# EasyEDA Pro project 5000A大电流-加法-v2+-+CT100.eprj, schematic Schematic1

## Sheets
1 P1: Board Name: Board1; Create Date: 2024-03-13; Page Name: P1; Project Name: 5000A大电流-加法-v2 - CT100; Schematic Name: Schematic1; Update Date: 2024-07-10; Company: 嘉立创EDA; Page Size: A4; Version: V1.0
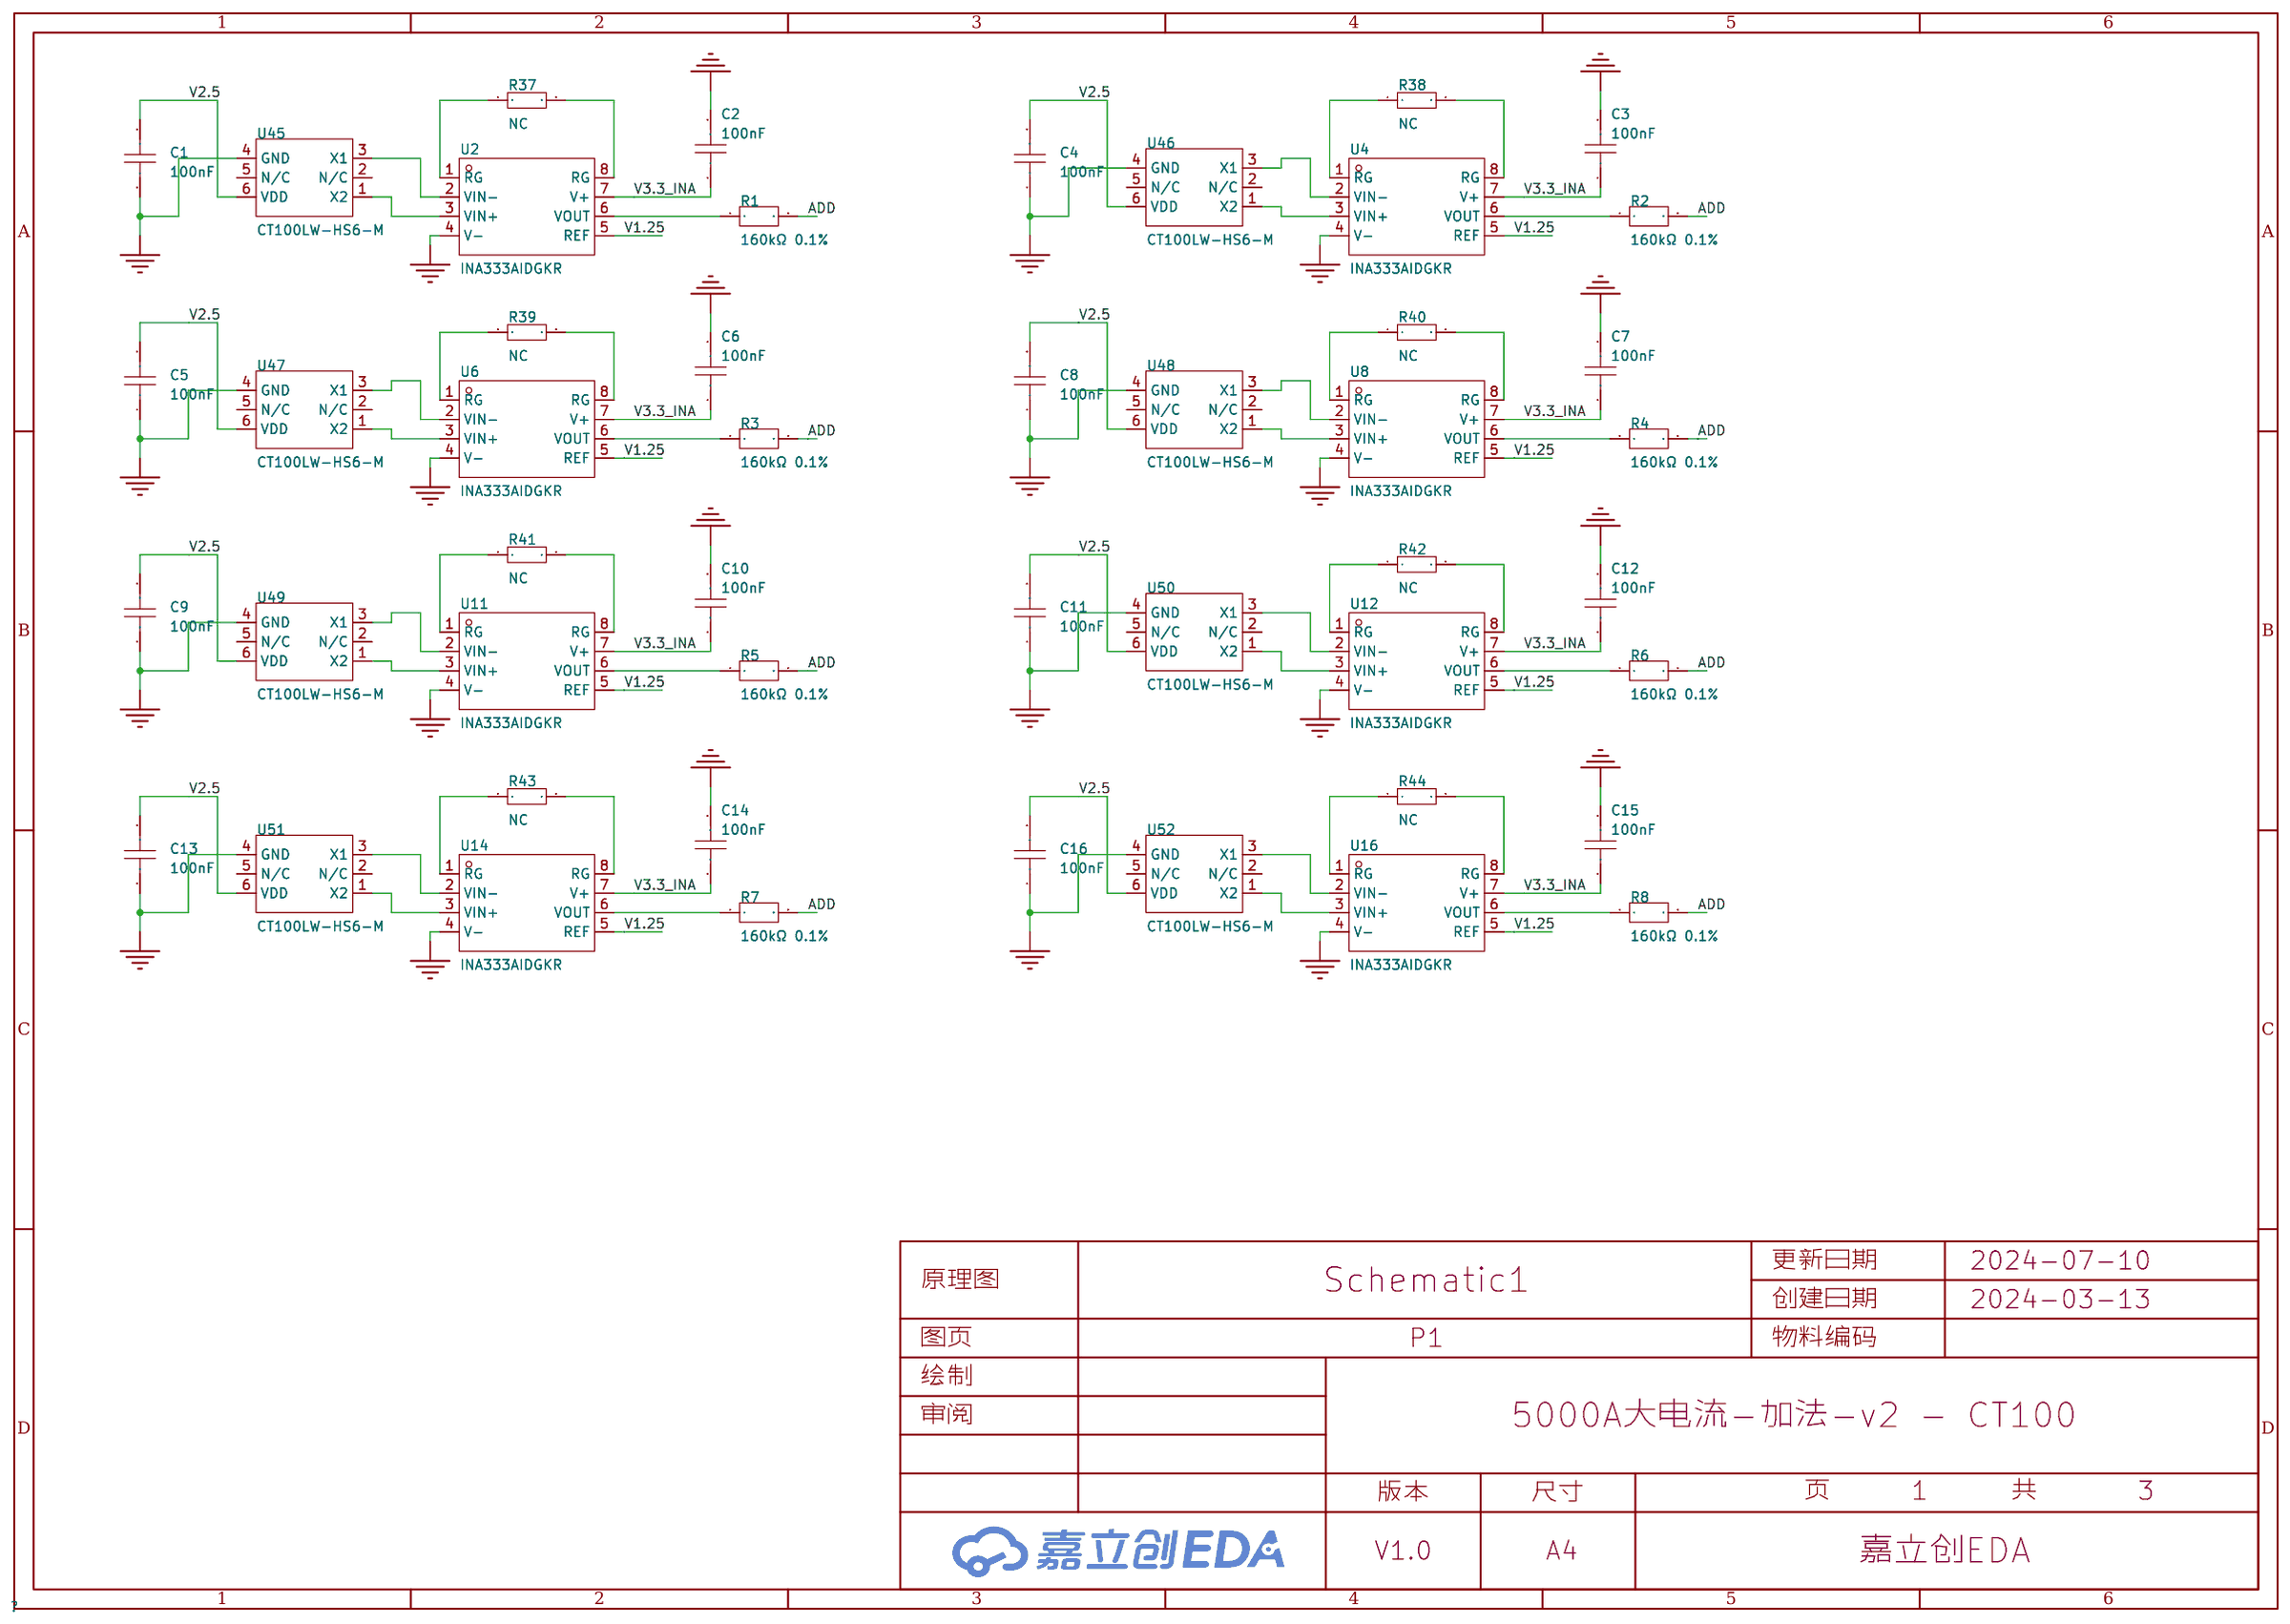
[diagram p0: P1]
2 P4: Page Name: P4; Update Date: 2024-07-25
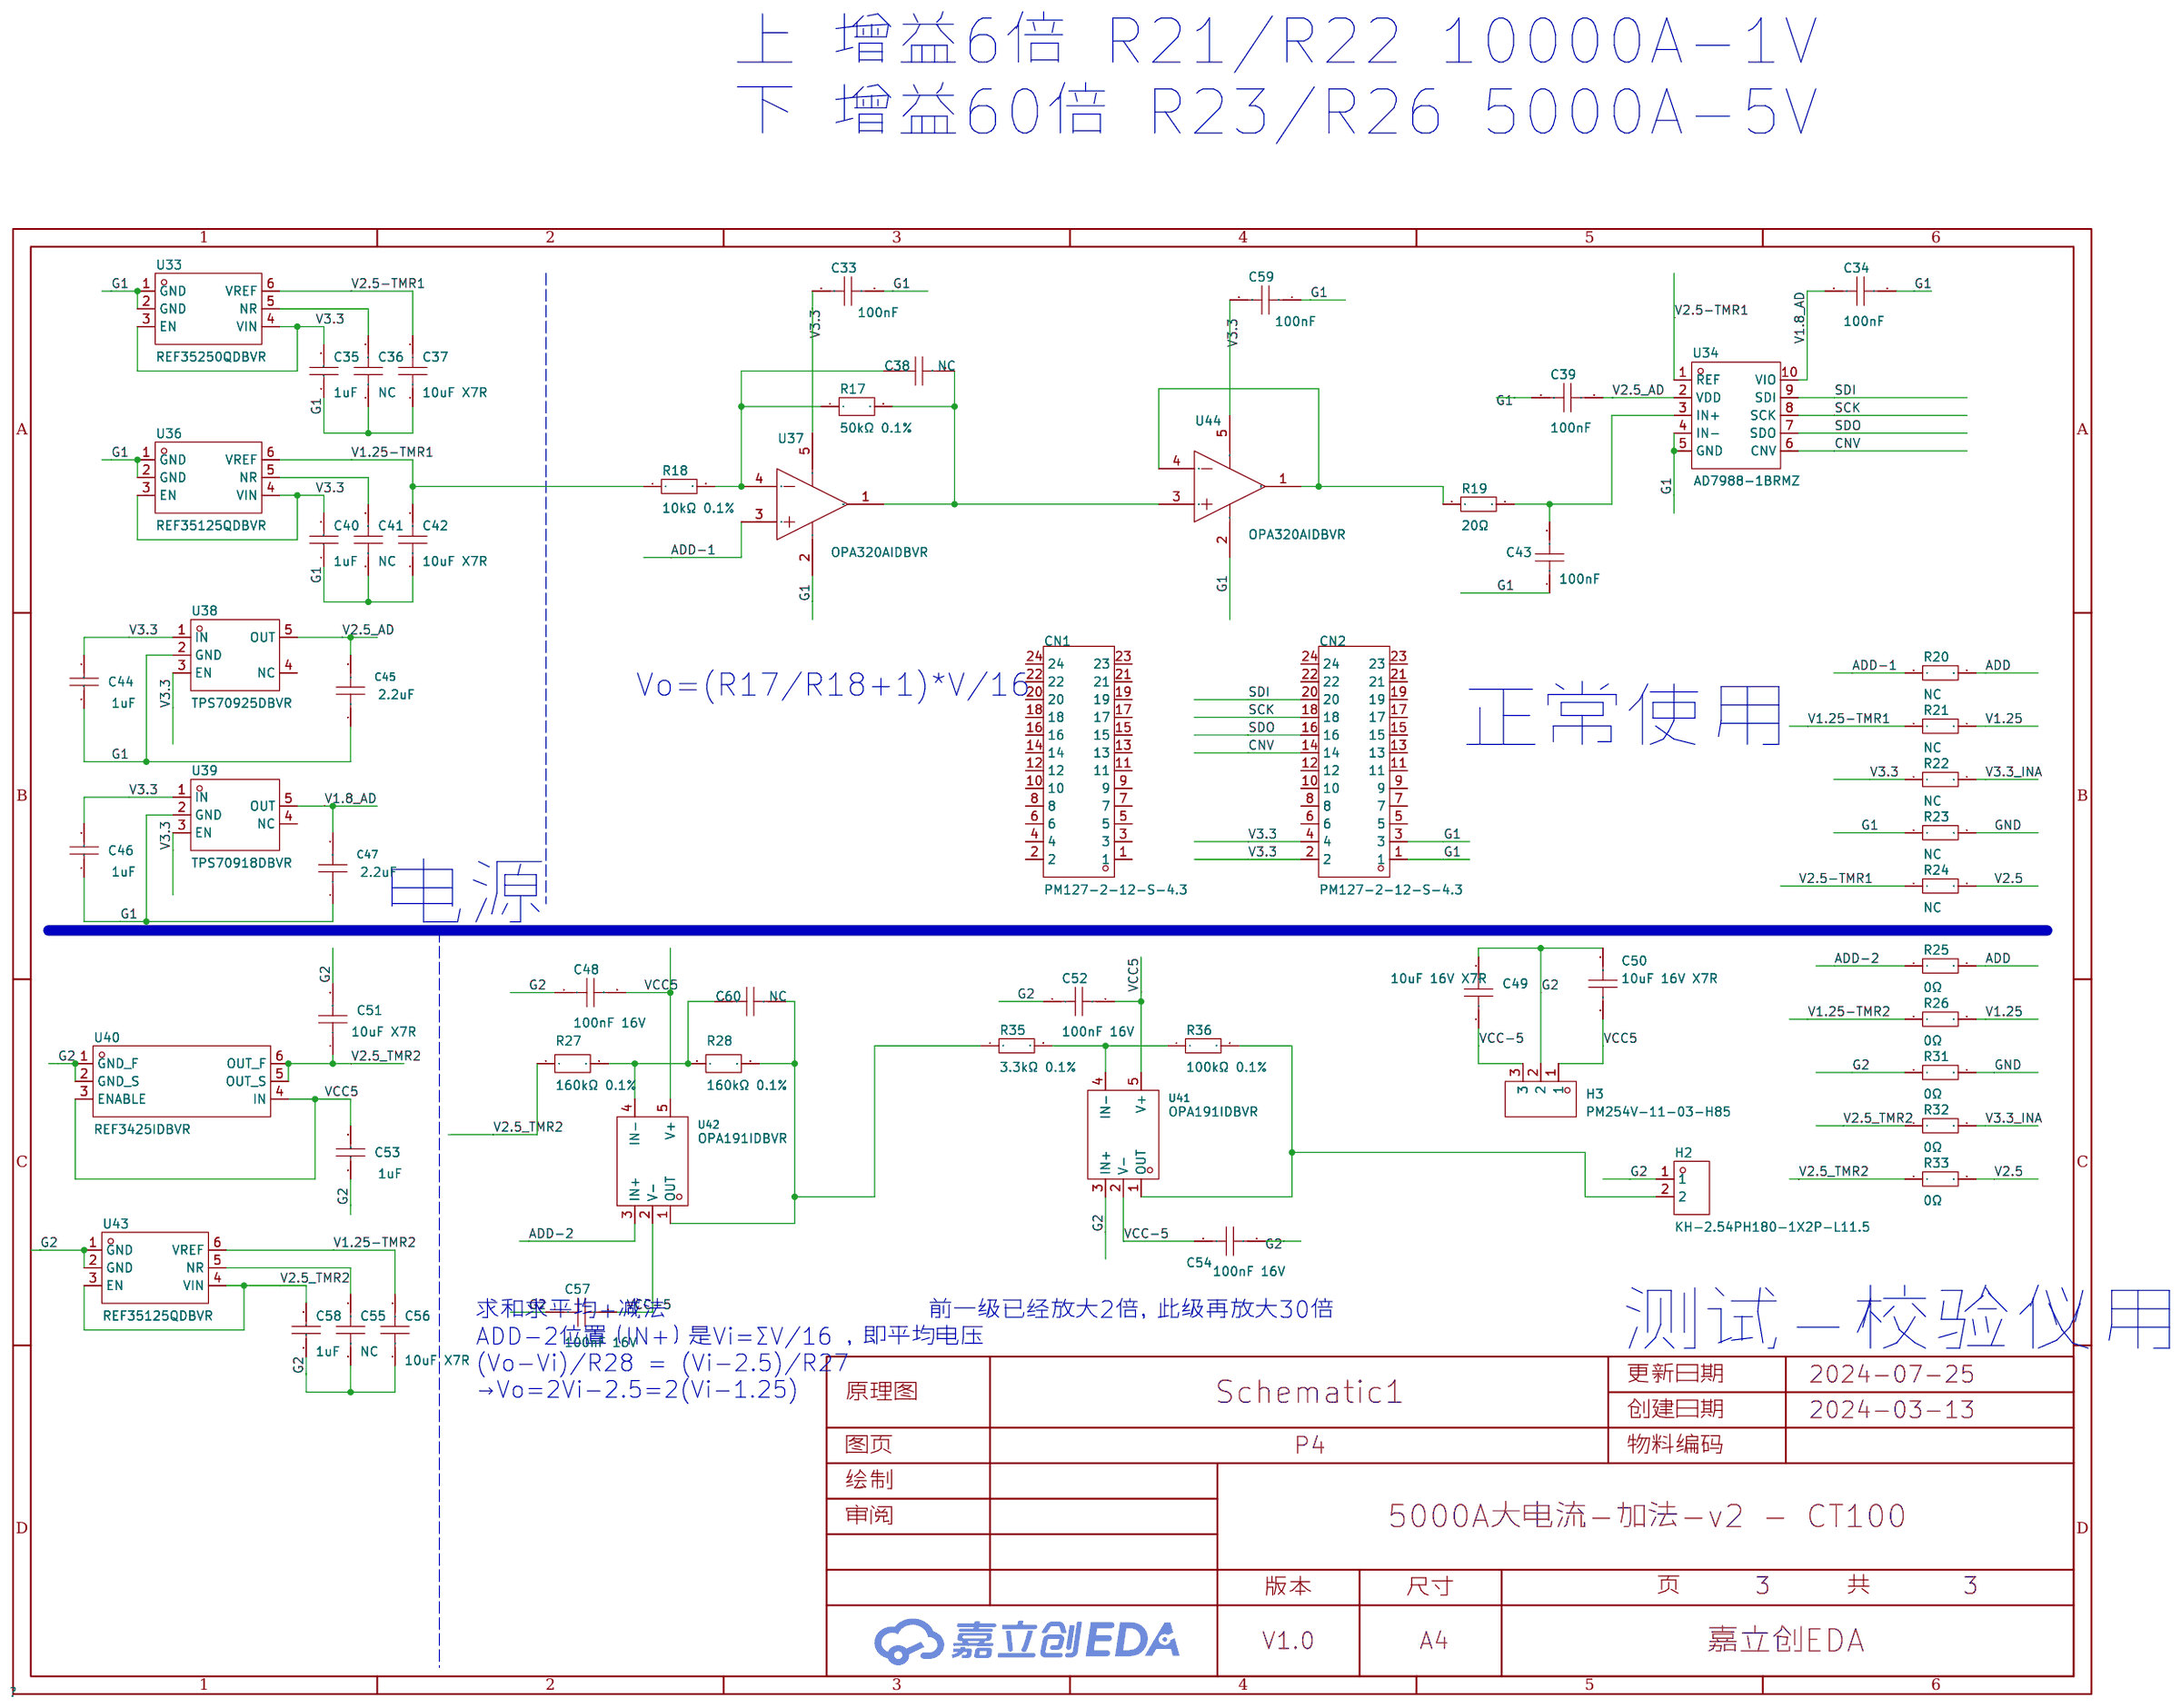
[diagram p1: P4]
3 P2: Create Date: 2024-04-08; Page Name: P2
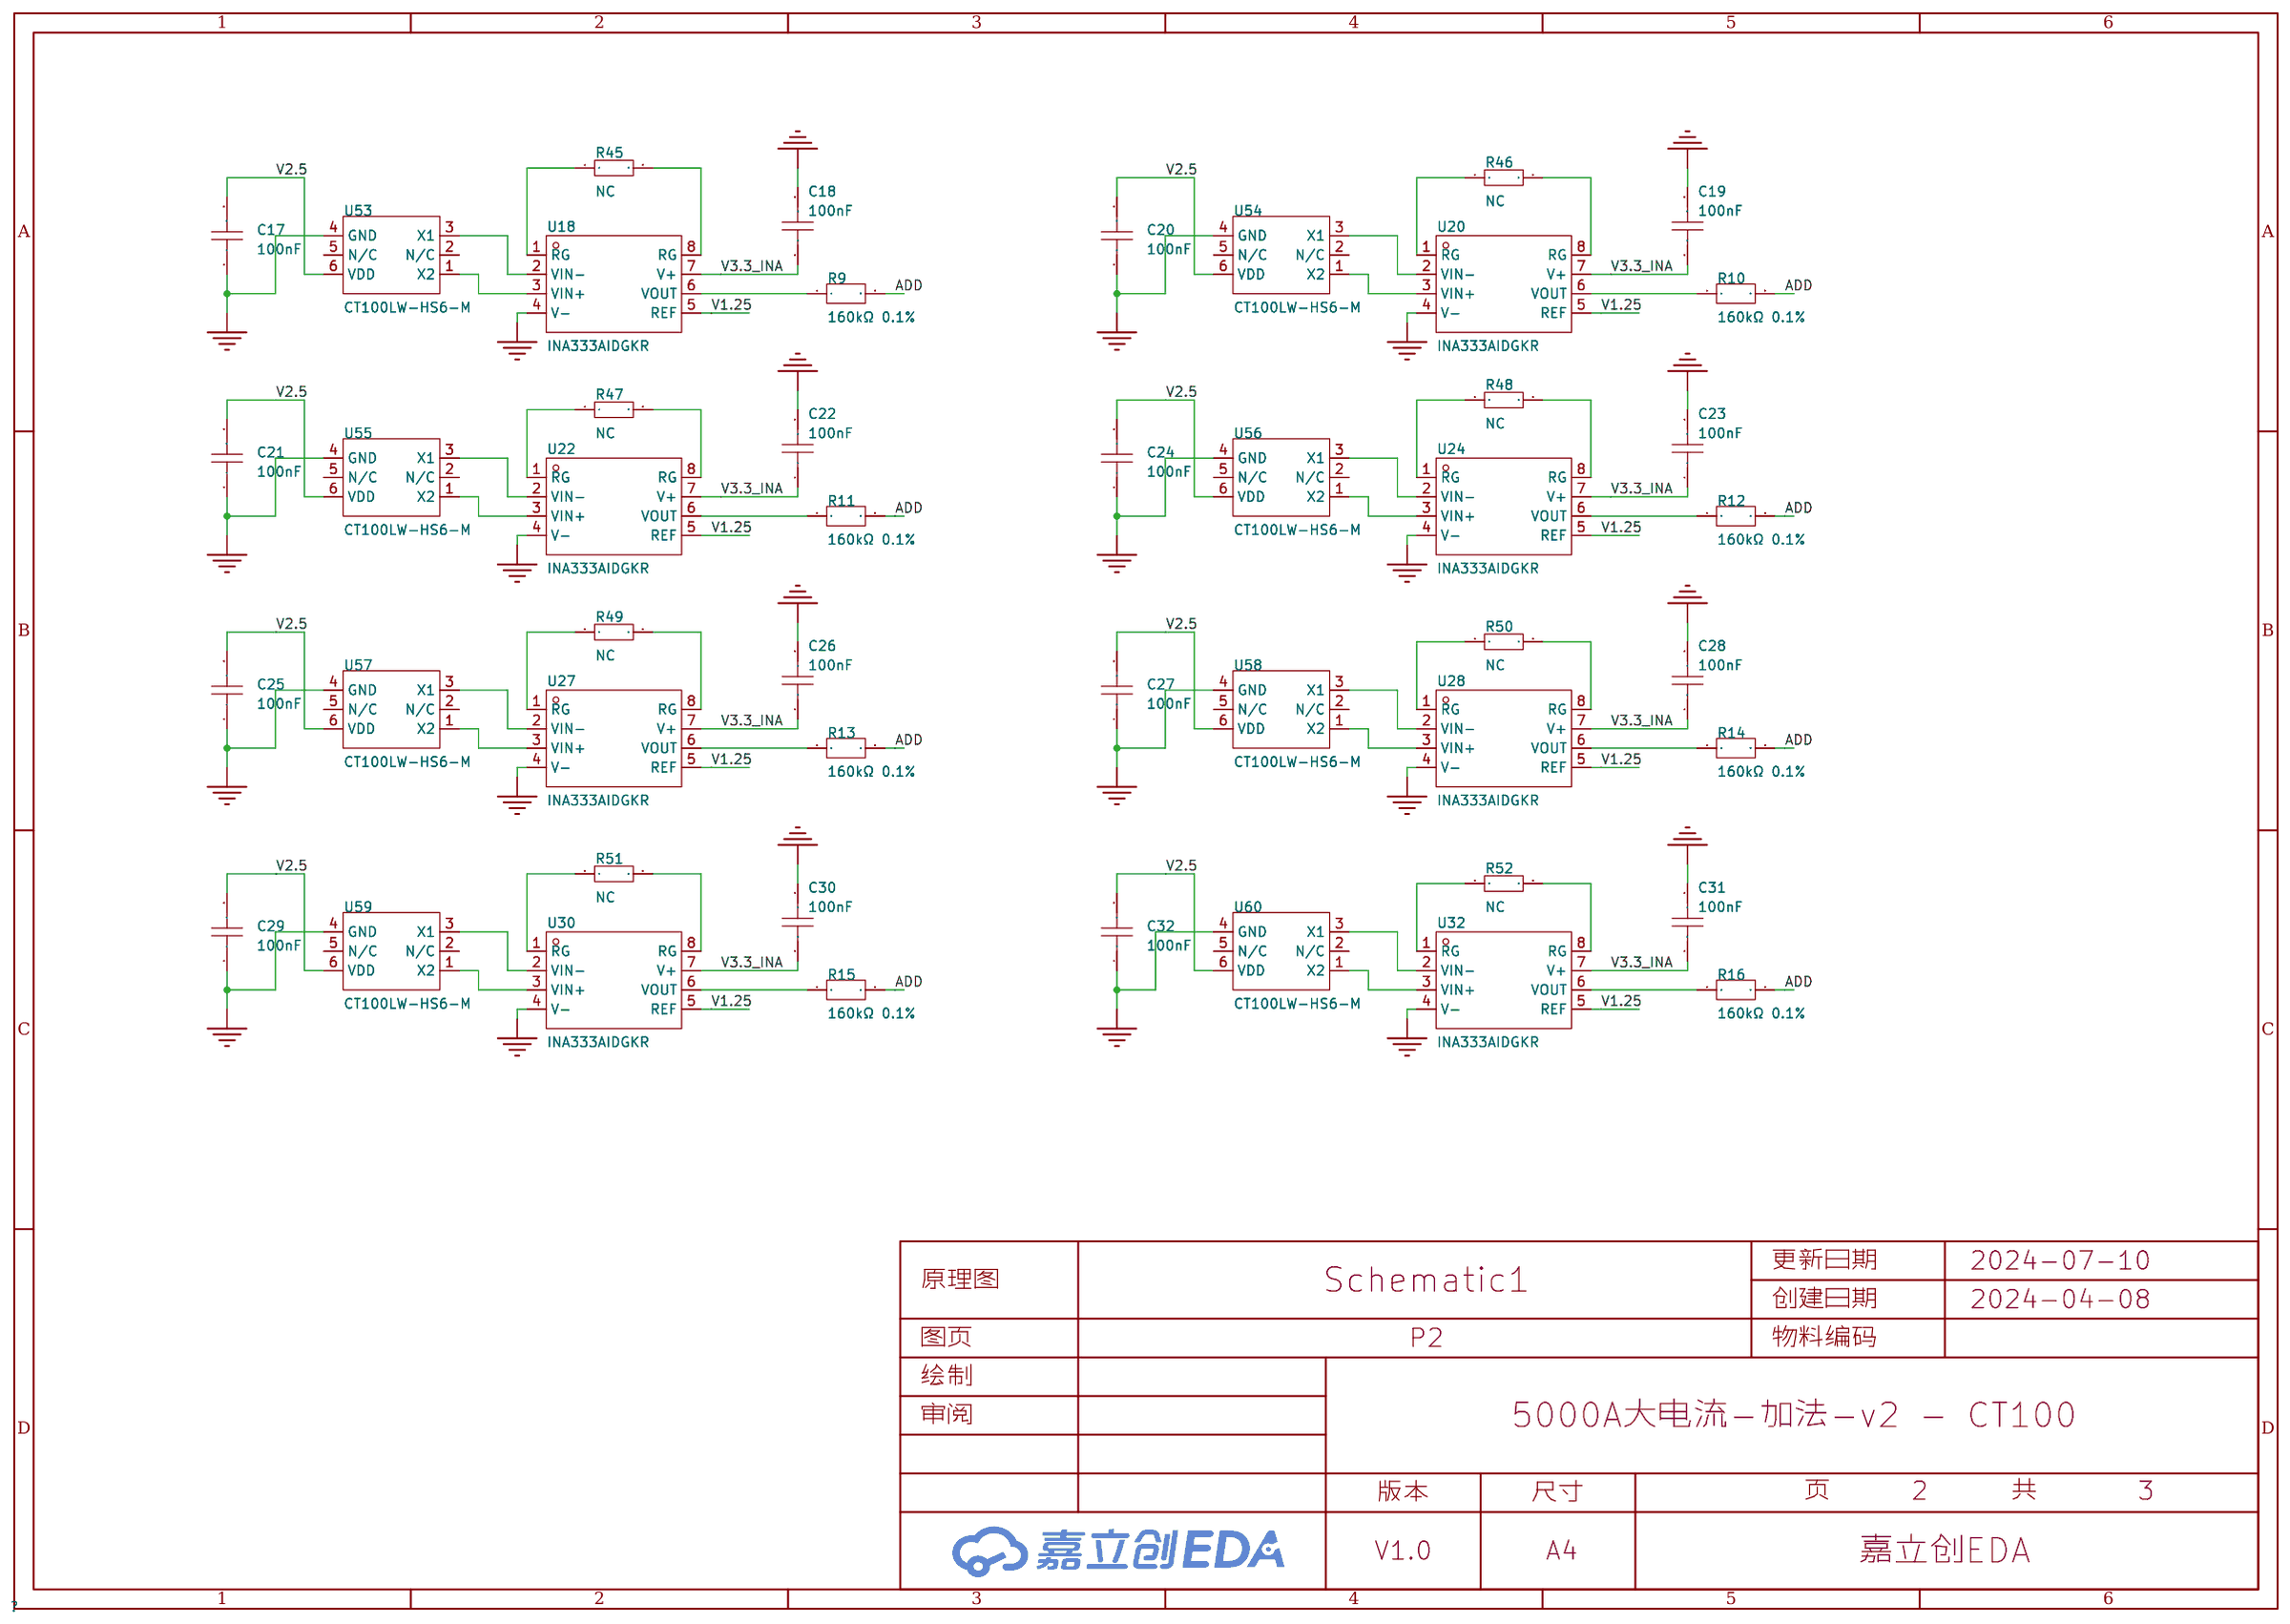
[diagram p2: P2]

## Parts
sheet P1
C1  100nF  [C0603]
C2  100nF  [C0603]
C3  100nF  [C0603]
C4  100nF  [C0603]
C5  100nF  [C0603]
C6  100nF  [C0603]
C7  100nF  [C0603]
C8  100nF  [C0603]
C9  100nF  [C0603]
C10  100nF  [C0603]
C11  100nF  [C0603]
C12  100nF  [C0603]
C13  100nF  [C0603]
C14  100nF  [C0603]
C15  100nF  [C0603]
C16  100nF  [C0603]
R1  160kΩ 0.1%  [R0603]
R2  160kΩ 0.1%  [R0603]
R3  160kΩ 0.1%  [R0603]
R4  160kΩ 0.1%  [R0603]
R5  160kΩ 0.1%  [R0603]
R6  160kΩ 0.1%  [R0603]
R7  160kΩ 0.1%  [R0603]
R8  160kΩ 0.1%  [R0603]
R37  NC  [R0603]
R38  NC  [R0603]
R39  NC  [R0603]
R40  NC  [R0603]
R41  NC  [R0603]
R42  NC  [R0603]
R43  NC  [R0603]
R44  NC  [R0603]
U2  INA333AIDGKR  [MSOP-8_L3.0-W3.0-P0.65-LS5.0-BL]
U4  INA333AIDGKR  [MSOP-8_L3.0-W3.0-P0.65-LS5.0-BL]
U6  INA333AIDGKR  [MSOP-8_L3.0-W3.0-P0.65-LS5.0-BL]
U8  INA333AIDGKR  [MSOP-8_L3.0-W3.0-P0.65-LS5.0-BL]
U11  INA333AIDGKR  [MSOP-8_L3.0-W3.0-P0.65-LS5.0-BL]
U12  INA333AIDGKR  [MSOP-8_L3.0-W3.0-P0.65-LS5.0-BL]
U14  INA333AIDGKR  [MSOP-8_L3.0-W3.0-P0.65-LS5.0-BL]
U16  INA333AIDGKR  [MSOP-8_L3.0-W3.0-P0.65-LS5.0-BL]
U45  CT100LW-HS6-M  [TSOT-23-6_L2.9-W1.6-P0.95-LS2.8-BL]
U46  CT100LW-HS6-M  [TSOT-23-6_L2.9-W1.6-P0.95-LS2.8-BL]
U47  CT100LW-HS6-M  [TSOT-23-6_L2.9-W1.6-P0.95-LS2.8-BL]
U48  CT100LW-HS6-M  [TSOT-23-6_L2.9-W1.6-P0.95-LS2.8-BL]
U49  CT100LW-HS6-M  [TSOT-23-6_L2.9-W1.6-P0.95-LS2.8-BL]
U50  CT100LW-HS6-M  [TSOT-23-6_L2.9-W1.6-P0.95-LS2.8-BL]
U51  CT100LW-HS6-M  [TSOT-23-6_L2.9-W1.6-P0.95-LS2.8-BL]
U52  CT100LW-HS6-M  [TSOT-23-6_L2.9-W1.6-P0.95-LS2.8-BL]
sheet P2
C17  100nF  [C0603]
C18  100nF  [C0603]
C19  100nF  [C0603]
C20  100nF  [C0603]
C21  100nF  [C0603]
C22  100nF  [C0603]
C23  100nF  [C0603]
C24  100nF  [C0603]
C25  100nF  [C0603]
C26  100nF  [C0603]
C27  100nF  [C0603]
C28  100nF  [C0603]
C29  100nF  [C0603]
C30  100nF  [C0603]
C31  100nF  [C0603]
C32  100nF  [C0603]
R9  160kΩ 0.1%  [R0603]
R10  160kΩ 0.1%  [R0603]
R11  160kΩ 0.1%  [R0603]
R12  160kΩ 0.1%  [R0603]
R13  160kΩ 0.1%  [R0603]
R14  160kΩ 0.1%  [R0603]
R15  160kΩ 0.1%  [R0603]
R16  160kΩ 0.1%  [R0603]
R45  NC  [R0603]
R46  NC  [R0603]
R47  NC  [R0603]
R48  NC  [R0603]
R49  NC  [R0603]
R50  NC  [R0603]
R51  NC  [R0603]
R52  NC  [R0603]
U18  INA333AIDGKR  [MSOP-8_L3.0-W3.0-P0.65-LS5.0-BL]
U20  INA333AIDGKR  [MSOP-8_L3.0-W3.0-P0.65-LS5.0-BL]
U22  INA333AIDGKR  [MSOP-8_L3.0-W3.0-P0.65-LS5.0-BL]
U24  INA333AIDGKR  [MSOP-8_L3.0-W3.0-P0.65-LS5.0-BL]
U27  INA333AIDGKR  [MSOP-8_L3.0-W3.0-P0.65-LS5.0-BL]
U28  INA333AIDGKR  [MSOP-8_L3.0-W3.0-P0.65-LS5.0-BL]
U30  INA333AIDGKR  [MSOP-8_L3.0-W3.0-P0.65-LS5.0-BL]
U32  INA333AIDGKR  [MSOP-8_L3.0-W3.0-P0.65-LS5.0-BL]
U53  CT100LW-HS6-M  [TSOT-23-6_L2.9-W1.6-P0.95-LS2.8-BL]
U54  CT100LW-HS6-M  [TSOT-23-6_L2.9-W1.6-P0.95-LS2.8-BL]
U55  CT100LW-HS6-M  [TSOT-23-6_L2.9-W1.6-P0.95-LS2.8-BL]
U56  CT100LW-HS6-M  [TSOT-23-6_L2.9-W1.6-P0.95-LS2.8-BL]
U57  CT100LW-HS6-M  [TSOT-23-6_L2.9-W1.6-P0.95-LS2.8-BL]
U58  CT100LW-HS6-M  [TSOT-23-6_L2.9-W1.6-P0.95-LS2.8-BL]
U59  CT100LW-HS6-M  [TSOT-23-6_L2.9-W1.6-P0.95-LS2.8-BL]
U60  CT100LW-HS6-M  [TSOT-23-6_L2.9-W1.6-P0.95-LS2.8-BL]
sheet P4
C33  100nF  [C0603]
C34  100nF  [C0603]
C35  1uF  [C0603]
C36  NC  [C0603]
C37  10uF X7R  [C0603]
C38  NC  [C0603]
C39  100nF  [C0603]
C40  1uF  [C0603]
C41  NC  [C0603]
C42  10uF X7R  [C0603]
C43  100nF  [C0603]
C44  1uF  [C0603]
C45  2.2uF  [C0603]
C46  1uF  [C0603]
C47  2.2uF  [C0603]
C48  100nF 16V  [C0603]
C49  10uF 16V X7R  [C0603]
C50  10uF 16V X7R  [C0603]
C51  10uF X7R  [C0603]
C52  100nF 16V  [C0603]
C53  1uF  [C0603]
C54  100nF 16V  [C0603]
C55  NC  [C0603]
C56  10uF X7R  [C0603]
C57  100nF 16V  [C0603]
C58  1uF  [C0603]
C59  100nF  [C0603]
C60  NC  [C0603]
CN1  PM127-2-12-S-4.3  [HDR-SMD_24P-P1.27-V-F-R2-C12-LS4.8]
CN2  PM127-2-12-S-4.3  [HDR-SMD_24P-P1.27-V-F-R2-C12-LS4.8]
H2  KH-2.54PH180-1X2P-L11.5  [HDR-TH_2P-P2.54-V-M]
H3  PM254V-11-03-H85  [HDR-TH_3P-P2.54-V-F]
R17  50kΩ 0.1%  [R0603]
R18  10kΩ 0.1%  [R0603]
R19  20Ω  [R0603]
R20  NC  [R0603]
R21  NC  [R0603]
R22  NC  [R0603]
R23  NC  [R0603]
R24  NC  [R0603]
R25  0Ω  [R0603]
R26  0Ω  [R0603]
R27  160kΩ 0.1%  [R0603]
R28  160kΩ 0.1%  [R0603]
R31  0Ω  [R0603]
R32  0Ω  [R0603]
R33  0Ω  [R0603]
R35  3.3kΩ 0.1%  [R0603]
R36  100kΩ 0.1%  [R0603]
U33  REF35250QDBVR  [SOT-23-6_L2.9-W1.6-P0.95-LS2.8-TL]
U34  AD7988-1BRMZ  [MSOP-10_L3.0-W3.0-P0.50-LS4.9-BL]
U36  REF35125QDBVR  [SOT-23-6_L2.9-W1.6-P0.95-LS2.8-BR]
U37  OPA320AIDBVR  [SOT-23-5_L3.0-W1.7-P0.95-LS2.8-BR]
U38  TPS70925DBVR  [SOT-23-5_L3.0-W1.7-P0.95-LS2.8-BL]
U39  TPS70918DBVR  [SOT-23-5_L3.0-W1.7-P0.95-LS2.8-BL]
U40  REF3425IDBVR  [SOT-23-6_L2.9-W1.6-P0.95-LS2.8-BR]
U41  OPA191IDBVR  [SOT-23-5_L2.9-W1.6-P0.95-LS2.8-BL]
U42  OPA191IDBVR  [SOT-23-5_L2.9-W1.6-P0.95-LS2.8-BL]
U43  REF35125QDBVR  [SOT-23-6_L2.9-W1.6-P0.95-LS2.8-BR]
U44  OPA320AIDBVR  [SOT-23-5_L3.0-W1.7-P0.95-LS2.8-BR]

## Library data of the parts
C1-C34 C39 C43 C48 C52 C54 C57 C59 = CC0603KRX7R6BB104: 容值:100nF;精度:±10%;额定电压:10V;材质(温度系数):X7R;; LCSC Part Name: 100nF ±10% 10V; Supplier Part: C519438; Manufacturer: YAGEO(国巨); Supplier Footprint: 0603; JLCPCB Part Class: Extended Part; Datasheet: https://atta.szlcsc.com/upload/public/pdf/source/20200423/C519438_5D8E3909BA347820A92655F61B0D4FC7.pdf; Supplier: LCSC; Tolerance: ±10%; Voltage Rated: 10V; Temperature Coefficient: X7R
R1-R16 R27 R28 = ERA3AEB164V: 电阻类型:薄膜电阻;阻值:160kΩ;精度:±0.1%;功率:100mW;最大工作电压:75V;温度系数:±25ppm/℃;; LCSC Part Name: 160kΩ ±0.1% 100mW 薄膜电阻; Supplier Part: C473259; Manufacturer: PANASONIC(松下); Supplier Footprint: 0603; JLCPCB Part Class: Extended Part; Datasheet: https://atta.szlcsc.com/upload/public/pdf/source/20200515/C543414_D3FB4A44C151AC19BA141503575FC797.pdf; Supplier: LCSC; Type: 薄膜电阻; Tolerance: ±0.1%; Power(Watts): 100mW; Overload Voltage (Max): 75V; Temperature Coefficient: ±25ppm/℃; Operating Temperature Range: -55℃~+155℃
R37-R52 = Res_0603: Supplier Footprint: 0603
U2 U4 U6 U8 U11 U12 U14 U16 U18 U20 U22 U24 U27 U28 U30 U32 = INA333AIDGKR: 放大器数:单路;输入偏置电流(Ib):70pA;输入失调电压(Vos):10uV;压摆率(SR):0.16V/us;带宽(-3db):150kHz;轨到轨:-;; Supplier Part: C19450; Manufacturer: TI(德州仪器); Supplier Footprint: MSOP-8; JLCPCB Part Class: Extended Part; Datasheet: https://www.ti.com/cn/lit/gpn/ina333; Supplier: LCSC; Number of Circuits: 单路; Current - Input Bias(Ib): 70pA; Voltage - Input Offset(Vos): 10uV; Slew Rate(SR): 0.16V/us; -3db Bandwidth: 150kHz; Operating Temperature: -40℃~+125℃
U45-U60 = CT100LW-HS6-M: 工作点(Gs):-;释放点(Gs):-;; LCSC Part Name: 1D线性传感器; Supplier Part: C1883595; Manufacturer: muRata(村田); Supplier Footprint: SOT-23-6; JLCPCB Part Class: Extended Part; Datasheet: https://atta.szlcsc.com/upload/public/pdf/source/20210610/6E844771CC74A357705B433F4A44EBAE.pdf; Supplier: LCSC; supply voltage: 1V~5.5V; Operating Temperature: -40℃~+125℃
C35 C40 C44 C46 C53 C58 = 0603B105K250NT: 容值:1uF;精度:±10%;额定电压:25V;材质(温度系数):X7R;; LCSC Part Name: 1uF ±10% 25V; Supplier Part: C59302; Manufacturer: FH(风华); Supplier Footprint: 0603; JLCPCB Part Class: Extended Part; Datasheet: https://atta.szlcsc.com/upload/public/pdf/source/20200305/C486355_26A10D38EF8C2A5C37091D0039909270.pdf; Supplier: LCSC; Tolerance: ±10%; Voltage Rated: 25V; Temperature Coefficient: X7R
C36 C37 C41 C42 C49-C51 C55 C56 = GRM188Z71A106KA73D: 容值:10uF;精度:±10%;额定电压:10V;材质(温度系数):X7R;; LCSC Part Name: 10uF ±10% 10V; Supplier Part: C2959727; Manufacturer: muRata(村田); Supplier Footprint: 0603; JLCPCB Part Class: Extended Part; Datasheet: https://atta.szlcsc.com/upload/public/pdf/source/20220328/6A4892B7E841253269A84FFE395E0578.pdf; Supplier: LCSC; Tolerance: ±10%; Voltage Rated: 10V; Temperature Coefficient: X7R
C38 C60 = CAP_0603: Supplier Footprint: 0603
C45 C47 = CL10A225KB8NNNC: 容值:2.2uF;精度:±10%;额定电压:50V;材质(温度系数):X5R;; LCSC Part Name: 2.2uF ±10% 50V; Supplier Part: C913904; Manufacturer: SAMSUNG(三星); Supplier Footprint: 0603; JLCPCB Part Class: Extended Part; Datasheet: https://atta.szlcsc.com/upload/public/pdf/source/20160218/1457707763339.pdf; Supplier: LCSC; Tolerance: ±10%; Voltage Rated: 50V; Temperature Coefficient: X5R
CN1 CN2 = PM127-2-12-S-4.3: 插孔结构:2x12P;间距:1.27mm;行距:1.27mm;圆孔/方孔:方孔;安装类型:立贴;排数:双排;总孔位数:24P;额定电流:1A;插孔方向:顶部;塑高:4.3mm;触头材质:磷青铜;工作温度范围:-40℃~+105℃;焊接温度(最大值):260℃@10S;; LCSC Part Name: 2x12P 间距:1.27mm 立贴; Supplier Part: C3975138; Manufacturer: HCTL(华灿天禄); Supplier Footprint: SMD,P=1.27mm; JLCPCB Part Class: Extended Part; Datasheet: https://atta.szlcsc.com/upload/public/pdf/source/20230609/8ADBEF410E6C2E5F1D14E81E7DE32270.pdf; Supplier: LCSC; Holes Structure: 2x12P; Pitch: 1.27mm; Row Spacing: 1.27mm; Circular Hole / Square Hole: 方孔; Mounting Type: 立贴; Number of Rows: 双排; Number of Holes: 24P; Current Rating (Max): 1A; Holes Direction: 顶部; Insulation Height: 4.3mm; Contact Material: 磷青铜; Operating Temperature Range: -40℃~+105℃; Soldering Temperature(Max): 260℃@10S
H2 = KH-2.54PH180-1X2P-L11.5: 插针结构:1x2P;间距:2.54mm;行距:-;圆针/方针:方针;安装类型:直插;排数:单排;总PIN位数:2P;额定电流:3A;额定电压:-;配合针长度:6mm;塑高:2.5mm;端接针长度:3mm;触头材质:-;工作温度范围:-40℃~+105℃;颜色:黑色;; LCSC Part Name: 间距:2.54mm 1x2P 直插 方针; Supplier Part: C2905434; Manufacturer: kinghelm(金航标); Supplier Footprint: 插件,P=2.54mm; JLCPCB Part Class: Extended Part; Datasheet: https://atta.szlcsc.com/upload/public/pdf/source/20211019/75EAF9E0823F75B5BB441C07BAE9F5E6.pdf; Supplier: LCSC; Pin Structure: 1x2P; Pitch: 2.54mm; Circluar Pins/Square Pins: 方针; Mounting Type: 直插; Number of Rows: 单排; Number of Pins: 2P; Current Rating (Max): 3A; Length of Mating Pin: 6mm; Insulation Height: 2.5mm; Length of End Connection Pin: 3mm; Operating Temperature Range: -40℃~+105℃; Color: 黑色
H3 = PM254V-11-03-H85: 插孔结构:1x3P;间距:2.54mm;行距:-;安装类型:直插;排数:单排;总孔位数:3P;塑高:-;触头材质:黄铜;触头镀层:-;; LCSC Part Name: 间距:2.54mm 1x3P 直插; Supplier Part: C541850; Manufacturer: XFCN(兴飞); Supplier Footprint: 插件,P=2.54mm; JLCPCB Part Class: Extended Part; Datasheet: https://atta.szlcsc.com/upload/public/pdf/source/20200518/C541849_85853D71FC67C51915A806977A588FDA.pdf; Supplier: LCSC; Holes Structure: 1x3P; Pitch: 2.54mm; Mounting Type: 直插; Number of Rows: 单排; Number of Holes: 3P; Contact Material: 黄铜
R17 = RT0603BRD0750KL: 电阻类型:薄膜电阻;阻值:50kΩ;精度:±0.1%;功率:100mW;最大工作电压:-;温度系数:±25ppm/℃;; LCSC Part Name: 薄膜电阻 50kΩ ±0.1% 100mW; Supplier Part: C861451; Manufacturer: YAGEO(国巨); Supplier Footprint: 0603; JLCPCB Part Class: Extended Part; Datasheet: https://atta.szlcsc.com/upload/public/pdf/source/20200610/C326738_5639A9F1B6EB6E4AE2197577D3456E7F.pdf; Supplier: LCSC; Type: 薄膜电阻; Tolerance: ±0.1%; Power(Watts): 100mW; Temperature Coefficient: ±25ppm/℃; Operating Temperature Range: -55℃~+155℃
R18 = RT0603BRD0710KL: 电阻类型:薄膜电阻;阻值:10kΩ;精度:±0.1%;功率:100mW;最大工作电压:75V;温度系数:±25ppm/℃;; LCSC Part Name: 薄膜电阻 10kΩ ±0.1% 100mW; Supplier Part: C95204; Manufacturer: YAGEO(国巨); Supplier Footprint: 0603; JLCPCB Part Class: Extended Part; Datasheet: https://atta.szlcsc.com/upload/public/pdf/source/20170217/1487301593756.pdf; Supplier: LCSC; Type: 薄膜电阻; Tolerance: ±0.1%; Power(Watts): 100mW; Overload Voltage (Max): 75V; Temperature Coefficient: ±25ppm/℃; Operating Temperature Range: -55℃~+155℃
R19 = RC0603FR-0720RL: 电阻类型:厚膜电阻;阻值:20Ω;精度:±1%;功率:100mW;最大工作电压:75V;温度系数:±100ppm/℃;; LCSC Part Name: 厚膜电阻 20Ω ±1% 100mW; Supplier Part: C125758; Manufacturer: YAGEO(国巨); Supplier Footprint: 0603; JLCPCB Part Class: Extended Part; Datasheet: https://atta.szlcsc.com/upload/public/pdf/source/20170815/C125758_1502799027253889202.pdf; Supplier: LCSC; Type: 厚膜电阻; Tolerance: ±1%; Power(Watts): 100mW; Overload Voltage (Max): 75V; Temperature Coefficient: ±100ppm/℃; Operating Temperature Range: -55℃~+155℃
R20-R26 R31-R33 = 0603WAF0000T5E: 电阻类型:厚膜电阻;阻值:0Ω;精度:±1%;功率:100mW;最大工作电压:75V;; LCSC Part Name: 0Ω ±1% 100mW 厚膜电阻; Supplier Part: C21189; Manufacturer: UNI-ROYAL(厚声); Supplier Footprint: 0603; JLCPCB Part Class: Basic Part; Datasheet: https://atta.szlcsc.com/upload/public/pdf/source/20200306/C422600_1E6D84923E4A46A82E41ADD87F860B5C.pdf; Supplier: LCSC; Type: 厚膜电阻; Tolerance: ±1%; Power(Watts): 100mW; Overload Voltage (Max): 75V; Operating Temperature Range: -55℃~+155℃
R35 = RT0603BRD073K3L: 电阻类型:薄膜电阻;阻值:3.3kΩ;精度:±0.1%;功率:100mW;最大工作电压:75V;温度系数:±25ppm/℃;; LCSC Part Name: 薄膜电阻 3.3kΩ ±0.1% 100mW; Supplier Part: C309653; Manufacturer: YAGEO(国巨); Supplier Footprint: 0603; JLCPCB Part Class: Extended Part; Datasheet: https://atta.szlcsc.com/upload/public/pdf/source/20181009/C309664_C7CEF5A7F4D0541F96EF5E54D941D229.pdf; Supplier: LCSC; Type: 薄膜电阻; Tolerance: ±0.1%; Power(Watts): 100mW; Overload Voltage (Max): 75V; Temperature Coefficient: ±25ppm/℃; Operating Temperature Range: -55℃~+155℃
R36 = RT0603BRD07100KL: 电阻类型:薄膜电阻;阻值:100kΩ;精度:±0.1%;功率:100mW;最大工作电压:75V;温度系数:±25ppm/℃;; LCSC Part Name: 薄膜电阻 100kΩ ±0.1% 100mW; Supplier Part: C122538; Manufacturer: YAGEO(国巨); Supplier Footprint: 0603; JLCPCB Part Class: Extended Part; Datasheet: https://atta.szlcsc.com/upload/public/pdf/source/20170721/C122538_1500619326323834092.pdf; Supplier: LCSC; Type: 薄膜电阻; Tolerance: ±0.1%; Power(Watts): 100mW; Overload Voltage (Max): 75V; Temperature Coefficient: ±25ppm/℃; Operating Temperature Range: -55℃~+155℃
U33 = REF35250QDBVR: 输出类型:固定;输入电压:2.75V~6V;输出电压:2.5V;输出电流:10mA;精度:±0.05%;; Supplier Part: C6265005; Manufacturer: TI(德州仪器); Supplier Footprint: SOT-23-6; JLCPCB Part Class: Extended Part; Datasheet: https://atta.szlcsc.com/upload/public/pdf/source/20230922/3B492FF426FCABB2933382D6402DB7FB.pdf; Supplier: LCSC; Output Type: 固定; Input Voltage: 2.75V~6V; Output Voltage: 2.5V; Output Current: 10mA; Tolerance: ±0.05%; Temperature Coefficient: 12ppm/℃; Reference Type: 串联; Supply Current: 2.6uA; Noise - 10Hz to 10kHz: 0.7ppmrms; Operating Temperature: -40℃~+125℃@(Ta)
U34 = AD7988-1BRMZ: 接口:SPI；DSP;电源电压:2.375V~2.625V;采样率:100kHz;分辨率:16位;; LCSC Part Name: AD7988 1BRMZ; Supplier Part: C1543054; Manufacturer: ADI(亚德诺); Supplier Footprint: MSOP-10; JLCPCB Part Class: Extended Part; Datasheet: https://atta.szlcsc.com/upload/public/pdf/source/20210601/10B76DDD03D6EFB4CBFC5C23E2140E45.pdf; Supplier: LCSC; Interface: SPI；DSP; number of channels: 1; Supply Voltage: 2.375V~2.625V; sampling frequency: 100kHz; resolution: 16位; Operating Temperature: -40℃~+125℃
U36 U43 = REF35125QDBVR: 输出类型:固定;输入电压:1.5V~6V;输出电压:1.25V;输出电流:10mA;精度:±0.05%;; Supplier Part: C7043252; Manufacturer: TI(德州仪器); Supplier Footprint: SOT-23-6; JLCPCB Part Class: Extended Part; Datasheet: https://atta.szlcsc.com/upload/public/pdf/source/20230922/3B492FF426FCABB2933382D6402DB7FB.pdf; Supplier: LCSC; Output Type: 固定; Input Voltage: 1.5V~6V; Output Voltage: 1.25V; Output Current: 10mA; Tolerance: ±0.05%; Temperature Coefficient: 12ppm/℃; Reference Type: 串联; Supply Current: 2.6uA; Noise - 10Hz to 10kHz: 0.7ppmrms; Operating Temperature: -40℃~+125℃@(Ta)
U37 U44 = OPA320AIDBVR: 放大器数:单路;增益带宽积(GBP):20MHz;输入偏置电流(Ib):0.2pA;压摆率(SR):10V/us;轨到轨:-;; Supplier Part: C92494; Manufacturer: TI(德州仪器); Supplier Footprint: SOT-23-5; JLCPCB Part Class: Extended Part; Datasheet: https://www.ti.com/cn/lit/gpn/opa320; Supplier: LCSC; Number of Circuits: 单路; Gain Bandwidth Product(GBP): 20MHz; Current - Input Bias(Ib): 0.2pA; Slew Rate(SR): 10V/us; Output Current: 65mA; Supply Current: 1.5mA; Operating Temperature: -40℃~+125℃
U38 = TPS70925DBVR: 输出类型:固定;最大输入电压:30V;输出电压:2.5V;最大输出电流:150mA;输出极性:正极;; Supplier Part: C575570; Manufacturer: TI(德州仪器); Supplier Footprint: SOT-23-5; JLCPCB Part Class: Extended Part; Datasheet: https://www.ti.com/cn/lit/gpn/tps709; Supplier: LCSC; Output Type: 固定; Maximum Input Voltage: 30V; Output Voltage: 2.5V; MAX Output Current: 150mA; standby current: 2.05uA; Operating Temperature: -40℃~+125℃; Output Polarity: 正极; Number of Outputs: 1
U39 = TPS70918DBVR: 输出类型:固定;最大输入电压:30V;输出电压:1.8V;最大输出电流:150mA;输出极性:正极;; Supplier Part: C779346; Manufacturer: TI(德州仪器); Supplier Footprint: SOT-23-5; JLCPCB Part Class: Extended Part; Datasheet: https://www.ti.com/cn/lit/gpn/tps709; Supplier: LCSC; Output Type: 固定; Maximum Input Voltage: 30V; Output Voltage: 1.8V; MAX Output Current: 150mA; standby current: 2.05uA; Operating Temperature: -40℃~+125℃; Output Polarity: 正极; Number of Outputs: 1
U40 = REF3425IDBVR: 输出类型:固定;输入电压:3V~12V;输出电压:2.5V;输出电流:10mA;精度:±0.05%;; Supplier Part: C187836; Manufacturer: TI(德州仪器); Supplier Footprint: SOT-23-6; JLCPCB Part Class: Extended Part; Datasheet: https://www.ti.com/cn/lit/gpn/ref3425; Supplier: LCSC; Output Type: 固定; Input Voltage: 3V~12V; Output Voltage: 2.5V; Output Current: 10mA; Tolerance: ±0.05%; Temperature Coefficient: 6ppm/℃; Reference Type: 串联; Supply Current: 95uA; Noise - 1/10Hz to 10Hz: 5uVp-p; Noise - 10Hz to 10kHz: 24uVrms; Operating Temperature: -40℃~+125℃@(Ta)
U41 U42 = OPA191IDBVR: 放大器数:单路;增益带宽积(GBP):2.5MHz;输入偏置电流(Ib):5pA;压摆率(SR):5.5V/us;轨到轨:-;; Supplier Part: C2058515; Manufacturer: TI(德州仪器); Supplier Footprint: SOT-23-5; JLCPCB Part Class: Extended Part; Datasheet: https://www.ti.com/cn/lit/gpn/opa4191; Supplier: LCSC; Number of Circuits: 单路; Gain Bandwidth Product(GBP): 2.5MHz; Current - Input Bias(Ib): 5pA; Slew Rate(SR): 5.5V/us; Operating Temperature: -40℃~+125℃

## Nets
GND: C1.1 C2.2 C3.2 C4.1 C5.1 C6.2 C7.2 C8.1 C9.1 C10.2 C11.1 C12.2 C13.1 C14.2 C15.2 C16.1 C17.1 C18.2 C19.2 C20.1 C21.1 C22.2 C23.2 C24.1 C25.1 C26.2 C27.1 C28.2 C29.1 C30.2 C31.2 C32.1 R23.2 R31.2 U2.4(V-) U4.4(V-) U6.4(V-) U8.4(V-) U11.4(V-) U12.4(V-) U14.4(V-) U16.4(V-) U18.4(V-) U20.4(V-) U22.4(V-) U24.4(V-) U27.4(V-) U28.4(V-) U30.4(V-) U32.4(V-) U45.4(GND) U46.4(GND) U47.4(GND) U48.4(GND) U49.4(GND) U50.4(GND) U51.4(GND) U52.4(GND) U53.4(GND) U54.4(GND) U55.4(GND) U56.4(GND) U57.4(GND) U58.4(GND) U59.4(GND) U60.4(GND)
V1.8_AD: C34.2 C47.2 U34.10(VIO) U39.5(OUT)
V1.25: R21.2 R26.2 U2.5(REF) U4.5(REF) U6.5(REF) U8.5(REF) U11.5(REF) U12.5(REF) U14.5(REF) U16.5(REF) U18.5(REF) U20.5(REF) U22.5(REF) U24.5(REF) U27.5(REF) U28.5(REF) U30.5(REF) U32.5(REF)
V1.25-TMR1: C42.2 R18.1 R21.1 U36.6(VREF)
V1.25-TMR2: C56.2 R26.1 U43.6(VREF)
V2.5: C1.2 C4.2 C5.2 C8.2 C9.2 C11.2 C13.2 C16.2 C17.2 C20.2 C21.2 C24.2 C25.2 C27.2 C29.2 C32.2 R24.2 R33.2 U45.6(VDD) U46.6(VDD) U47.6(VDD) U48.6(VDD) U49.6(VDD) U50.6(VDD) U51.6(VDD) U52.6(VDD) U53.6(VDD) U54.6(VDD) U55.6(VDD) U56.6(VDD) U57.6(VDD) U58.6(VDD) U59.6(VDD) U60.6(VDD)
V2.5-TMR1: C37.2 R24.1 U33.6(VREF) U34.1(REF)
V2.5_AD: C39.1 C45.2 U34.2(VDD) U38.5(OUT)
V2.5_TMR2: C51.1 C58.2 R27.1 R32.1 R33.1 U40.5(OUT_S) U40.6(OUT_F) U43.3(EN) U43.4(VIN)
V3.3: C33.2 C35.2 C40.2 C44.2 C46.2 C59.2 CN2.2 CN2.4 R22.1 U33.3(EN) U33.4(VIN) U36.3(EN) U36.4(VIN) U37.5(V+) U38.1(IN) U38.3(EN) U39.1(IN) U39.3(EN) U44.5(V+)
V3.3_INA: C2.1 C3.1 C6.1 C7.1 C10.1 C12.1 C14.1 C15.1 C18.1 C19.1 C22.1 C23.1 C26.1 C28.1 C30.1 C31.1 R22.2 R32.2 U2.7(V+) U4.7(V+) U6.7(V+) U8.7(V+) U11.7(V+) U12.7(V+) U14.7(V+) U16.7(V+) U18.7(V+) U20.7(V+) U22.7(V+) U24.7(V+) U27.7(V+) U28.7(V+) U30.7(V+) U32.7(V+)
VCC5: C48.2 C50.1 C52.2 C53.2 H3.1 U40.3(ENABLE) U40.4(IN) U41.5(V+) U42.5(V+)
VCC-5: C49.1 C54.2 C57.2 H3.3 U41.2(V-) U42.2(V-)
ADD: R1.2 R2.2 R3.2 R4.2 R5.2 R6.2 R7.2 R8.2 R9.2 R10.2 R11.2 R12.2 R13.2 R14.2 R15.2 R16.2 R20.2 R25.2
ADD-1: R20.1 U37.3(IN+)
ADD-2: R25.1 U42.3(IN+)
CNV: CN2.14 U34.6(CNV)
G1: C33.1 C34.1 C35.1 C36.1 C37.1 C39.2 C40.1 C41.1 C42.1 C43.1 C44.1 C45.1 C46.1 C47.1 C59.1 CN2.1 CN2.3 R23.1 U33.1(GND) U33.2(GND) U34.4(IN-) U34.5(GND) U36.1(GND) U36.2(GND) U37.2(V-) U38.2(GND) U39.2(GND) U44.2(V-)
G2: C48.1 C49.2 C50.2 C51.2 C52.1 C53.1 C54.1 C55.1 C56.1 C57.1 C58.1 H2.1 H3.2 R31.1 U40.1(GND_F) U40.2(GND_S) U41.3(IN+) U43.1(GND) U43.2(GND)
SCK: CN2.18 U34.8(SCK)
SDI: CN2.20 U34.9(SDI)
SDO: CN2.16 U34.7(SDO)
$1N31104: U2.3(VIN+) U45.1(X2)
$1N31108: U2.2(VIN-) U45.3(X1)
$1N91179: R1.1 U2.6(VOUT)
$1N91602: U4.3(VIN+) U46.1(X2)
$1N91603: U4.2(VIN-) U46.3(X1)
$1N91607: R2.1 U4.6(VOUT)
$1N93030: U6.3(VIN+) U47.1(X2)
$1N93031: U6.2(VIN-) U47.3(X1)
$1N93035: R3.1 U6.6(VOUT)
$1N93040: U8.3(VIN+) U48.1(X2)
$1N93041: U8.2(VIN-) U48.3(X1)
$1N93045: R4.1 U8.6(VOUT)
$1N94188: U11.3(VIN+) U49.1(X2)
$1N94189: U11.2(VIN-) U49.3(X1)
$1N94193: R5.1 U11.6(VOUT)
$1N94198: U12.3(VIN+) U50.1(X2)
$1N94199: U12.2(VIN-) U50.3(X1)
$1N94203: R6.1 U12.6(VOUT)
$1N95348: U14.3(VIN+) U51.1(X2)
$1N95349: U14.2(VIN-) U51.3(X1)
$1N95353: R7.1 U14.6(VOUT)
$1N95358: U16.3(VIN+) U52.1(X2)
$1N95359: U16.2(VIN-) U52.3(X1)
$1N95363: R8.1 U16.6(VOUT)
$1N99606: R37.1 U2.1(RG)
$1N99611: R37.2 U2.8(RG)
$1N99617: R38.1 U4.1(RG)
$1N99623: R38.2 U4.8(RG)
$1N99629: R39.1 U6.1(RG)
$1N99635: R39.2 U6.8(RG)
$1N99641: R40.1 U8.1(RG)
$1N99647: R40.2 U8.8(RG)
$1N99653: R41.1 U11.1(RG)
$1N99659: R41.2 U11.8(RG)
$1N99665: R42.1 U12.1(RG)
$1N99671: R42.2 U12.8(RG)
$1N99677: R43.1 U14.1(RG)
$1N99683: R43.2 U14.8(RG)
$1N99689: R44.1 U16.1(RG)
$1N99695: R44.2 U16.8(RG)
$2N6645: C43.2 R19.2 U34.3(IN+)
$2N39211: C60.1 R27.2 R28.1 U42.4(IN-)
$2N40944: R35.2 R36.1 U41.4(IN-)
$2N60194: C55.2 U43.5(NR)
$2N63629: C41.2 U36.5(NR)
$2N63634: C36.2 U33.5(NR)
$2N69677: H2.2 R36.2 U41.1(OUT)
$2N70265: C60.2 R28.2 R35.1 U42.1(OUT)
$2N79300: C38.2 R17.2 U37.1(OUT) U44.3(IN+)
$2N79301: C38.1 R17.1 R18.2 U37.4(IN-)
$2N85861: R19.1 U44.1(OUT) U44.4(IN-)
$3N33672: U18.3(VIN+) U53.1(X2)
$3N33673: U18.2(VIN-) U53.3(X1)
$3N33677: R9.1 U18.6(VOUT)
$3N33682: U20.3(VIN+) U54.1(X2)
$3N33683: U20.2(VIN-) U54.3(X1)
$3N33687: R10.1 U20.6(VOUT)
$3N33692: U22.3(VIN+) U55.1(X2)
$3N33693: U22.2(VIN-) U55.3(X1)
$3N33697: R11.1 U22.6(VOUT)
$3N33702: U24.3(VIN+) U56.1(X2)
$3N33703: U24.2(VIN-) U56.3(X1)
$3N33707: R12.1 U24.6(VOUT)
$3N33712: U27.3(VIN+) U57.1(X2)
$3N33713: U27.2(VIN-) U57.3(X1)
$3N33717: R13.1 U27.6(VOUT)
$3N33722: U28.3(VIN+) U58.1(X2)
$3N33723: U28.2(VIN-) U58.3(X1)
$3N33727: R14.1 U28.6(VOUT)
$3N33732: U30.3(VIN+) U59.1(X2)
$3N33733: U30.2(VIN-) U59.3(X1)
$3N33737: R15.1 U30.6(VOUT)
$3N33742: U32.3(VIN+) U60.1(X2)
$3N33743: U32.2(VIN-) U60.3(X1)
$3N33747: R16.1 U32.6(VOUT)
$3N38096: R45.1 U18.1(RG)
$3N38101: R45.2 U18.8(RG)
$3N38107: R46.1 U20.1(RG)
$3N38113: R46.2 U20.8(RG)
$3N38119: R47.1 U22.1(RG)
$3N38125: R47.2 U22.8(RG)
$3N38131: R48.1 U24.1(RG)
$3N38137: R48.2 U24.8(RG)
$3N38143: R49.1 U27.1(RG)
$3N38149: R49.2 U27.8(RG)
$3N38155: R50.1 U28.1(RG)
$3N38161: R50.2 U28.8(RG)
$3N38167: R51.1 U30.1(RG)
$3N38173: R51.2 U30.8(RG)
$3N38179: R52.1 U32.1(RG)
$3N38185: R52.2 U32.8(RG)

Not connected (* = marked no-connect by the designer): CN1 1 2 3 4 5 6 7 8 9 10 11 12 13 14 15 16 17 18 19 20 21 22 23 24; CN2 5 6 7 8 9 10 11 12 13 15 17 19 21 22 23 24; U38 4(NC); U39 4(NC); U45 2(N/C) 5(N/C); U46 2(N/C) 5(N/C); U47 2(N/C) 5(N/C); U48 2(N/C) 5(N/C); U49 2(N/C) 5(N/C); U50 2(N/C) 5(N/C); U51 2(N/C) 5(N/C); U52 2(N/C) 5(N/C); U53 2(N/C) 5(N/C); U54 2(N/C) 5(N/C); U55 2(N/C) 5(N/C); U56 2(N/C) 5(N/C); U57 2(N/C) 5(N/C); U58 2(N/C) 5(N/C); U59 2(N/C) 5(N/C); U60 2(N/C) 5(N/C)

## Notes on the sheets
sheet 2
- 上 增益6倍 R21/R22 10000A-1V
  下 增益60倍 R23/R26 5000A-5V
- Vo=(R17/R18+1)*V/16
- 正常使用
- 电源
- 前一级已经放大2倍，此级再放大30倍
- 测试-校验仪用
- 求和求平均+减法
  ADD-2位置（IN+）是Vi=ΣV/16 ，即平均电压
  (Vo-Vi)/R28 = (Vi-2.5)/R27
  →Vo=2Vi-2.5=2(Vi-1.25)
